# Altium schematic sheet Cpcis_connectors_P4_P5_P6.SchDoc
size 420 x 297 mm; DocumentNumber: 4; SheetNumber: 4; SheetTotal: 8; EDA_Number: ARTIQ; ModifiedBy: -; Title2: -; DivGrp: ISE; ModifiedDate: -
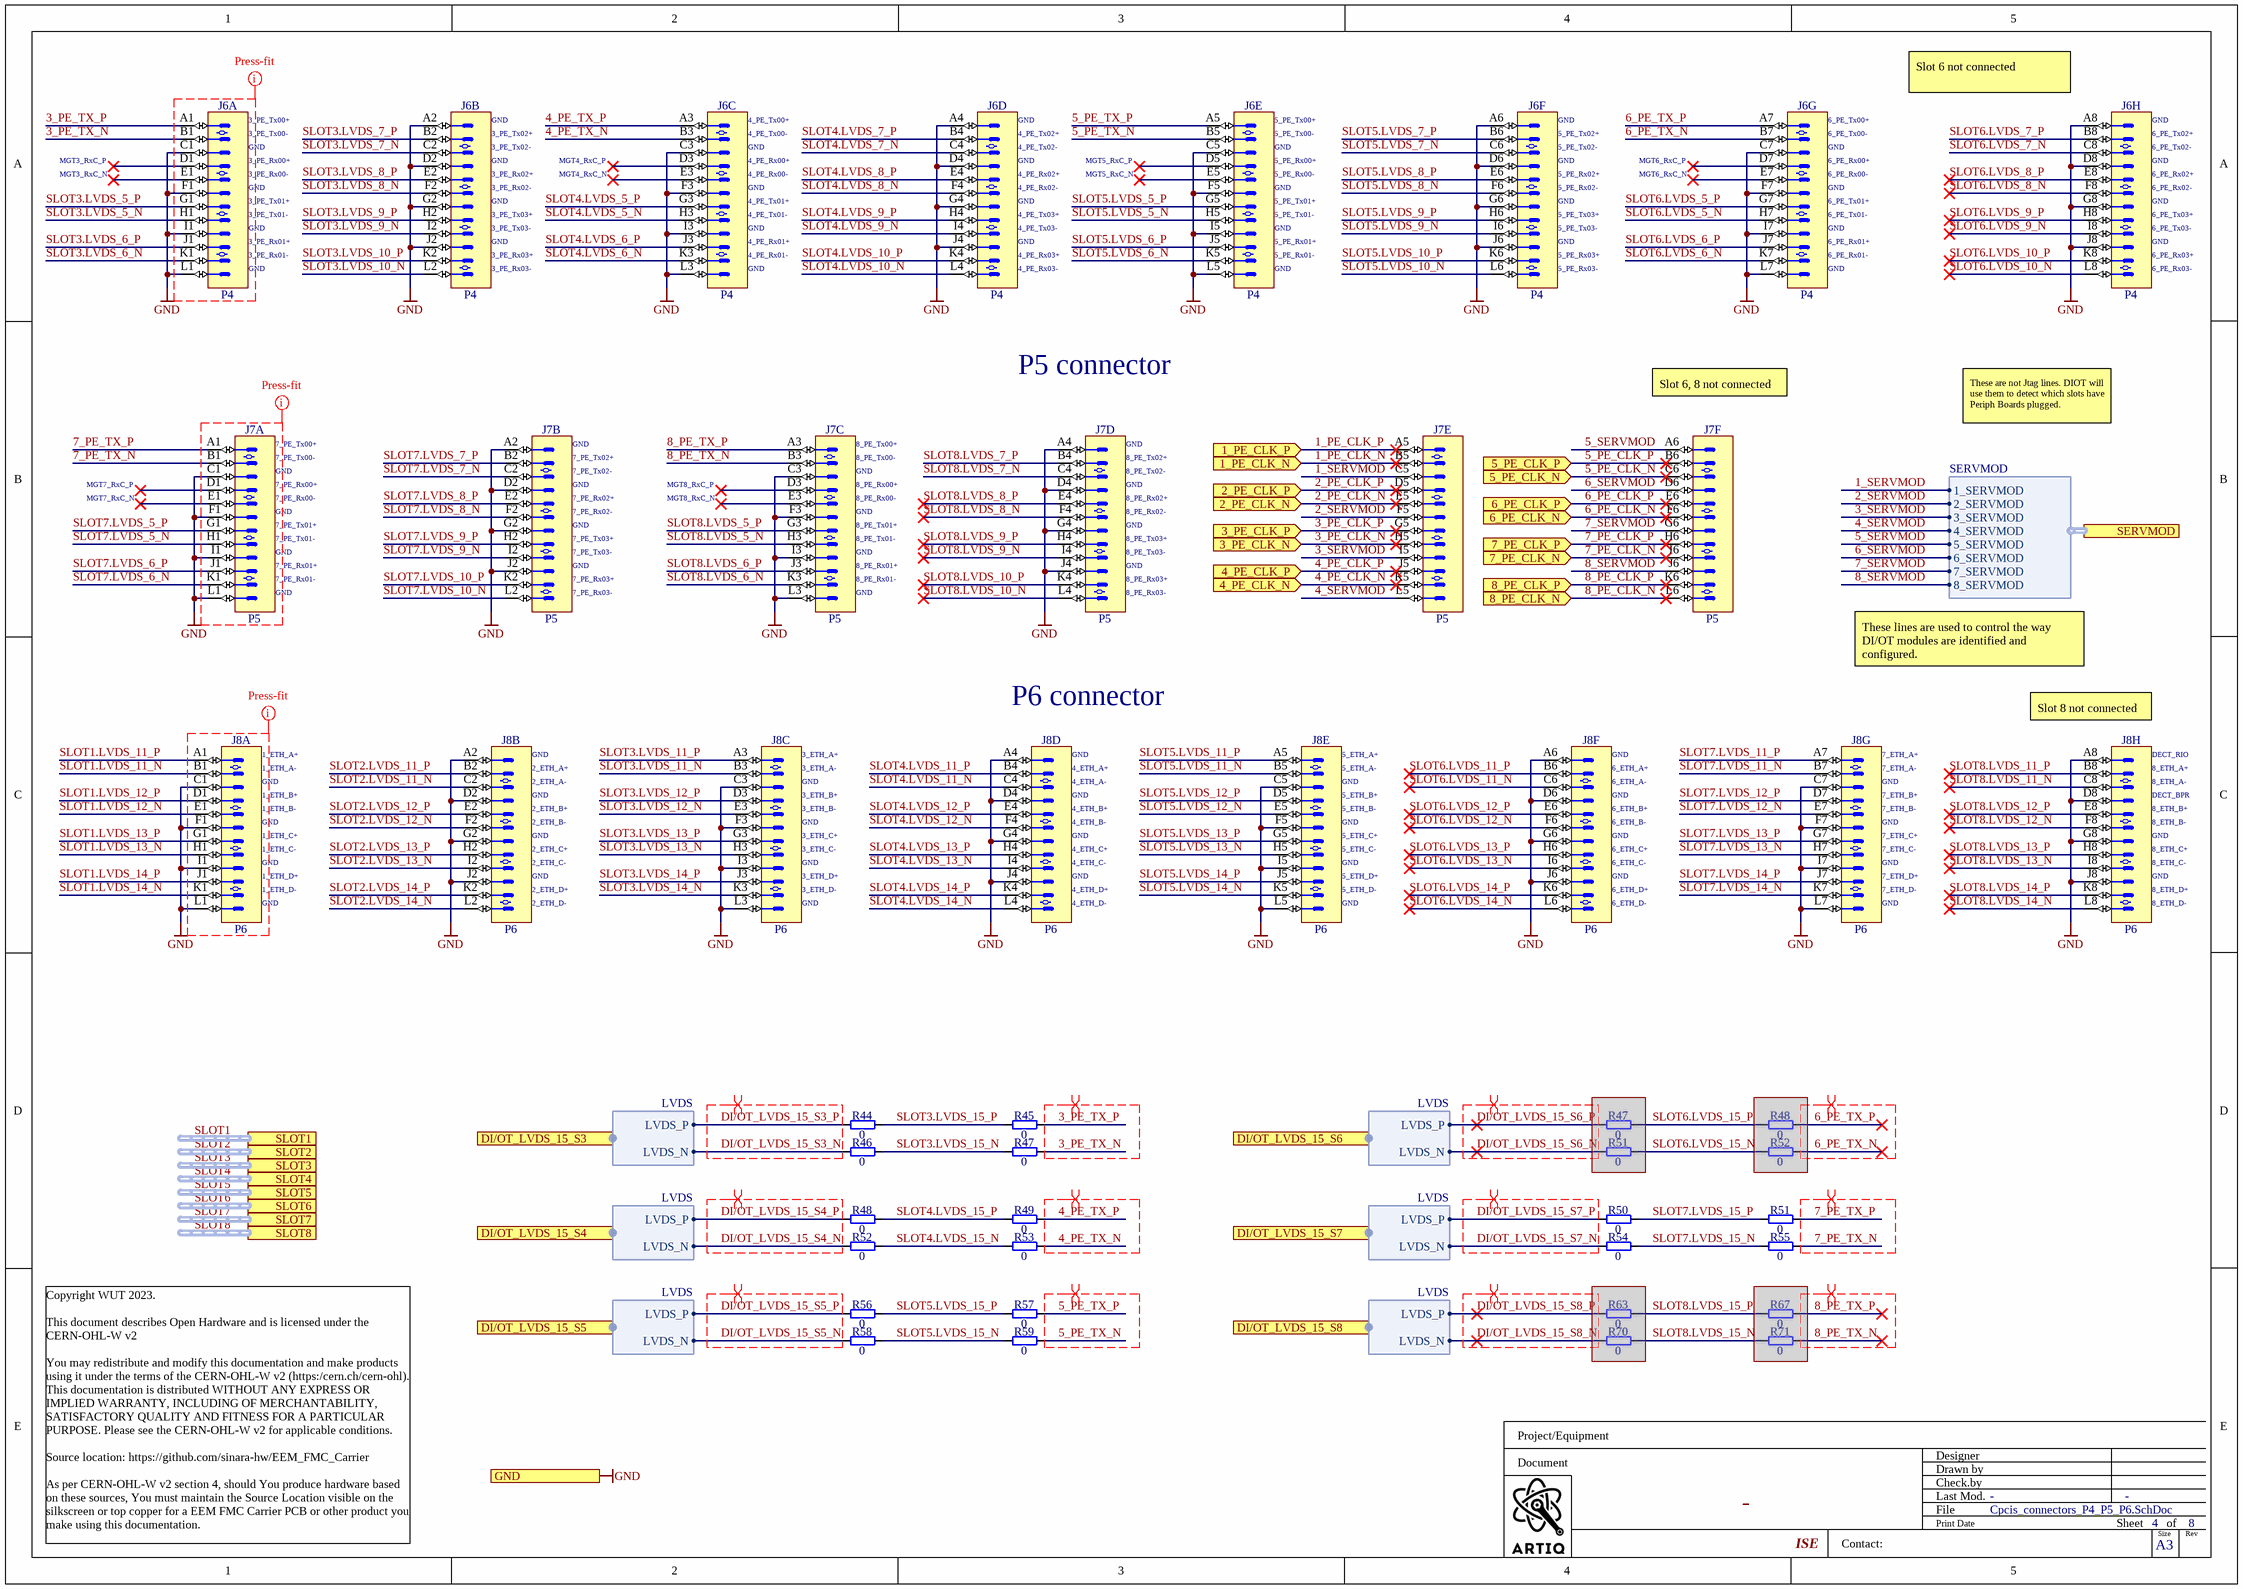
[diagram p0: Cpcis_connectors_P4_P5_P6.SchDoc]

## Parts
(Parts that share a designator on the sheet are numbered #1, #2 ... from top to bottom, then left to right.)
J6  P4  [AMPHENOL_10052837-101LF]  (parts A,B,C,D,E,F,G,H of 8)
J7  P5  [AMPHENOL_10052824-101LF]  (parts A,B,C,D,E,F of 6)
J8  P6  [AMPHENOL_10052838-101LF]  (parts A,B,C,D,E,F,G,H of 8)
R44  0  [RESC0603X28N]
R45  0  [RESC0603X28N]
R46  0  [RESC0603X28N]
R47#1  0  [RESC0603X28N]  (masked out: inside a compile mask, not in the netlist)
R47#2  0  [RESC0603X28N]
R48#1  0  [RESC0603X28N]  (masked out: inside a compile mask, not in the netlist)
R48#2  0  [RESC0603X28N]
R49  0  [RESC0603X28N]
R50  0  [RESC0603X28N]
R51#1  0  [RESC0603X28N]  (masked out: inside a compile mask, not in the netlist)
R51#2  0  [RESC0603X28N]
R52#1  0  [RESC0603X28N]  (masked out: inside a compile mask, not in the netlist)
R52#2  0  [RESC0603X28N]
R53  0  [RESC0603X28N]
R54  0  [RESC0603X28N]
R55  0  [RESC0603X28N]
R56  0  [RESC0603X28N]
R57  0  [RESC0603X28N]
R58  0  [RESC0603X28N]
R59  0  [RESC0603X28N]
R63  0  [RESC0603X28N]  (masked out: inside a compile mask, not in the netlist)
R67  0  [RESC0603X28N]  (masked out: inside a compile mask, not in the netlist)
R70  0  [RESC0603X28N]  (masked out: inside a compile mask, not in the netlist)
R71  0  [RESC0603X28N]  (masked out: inside a compile mask, not in the netlist)

## Ports
1_PE_CLK_N (in), 1_PE_CLK_P (in), 2_PE_CLK_N (in), 2_PE_CLK_P (in), 3_PE_CLK_N (in), 3_PE_CLK_P (in), 4_PE_CLK_N (in), 4_PE_CLK_P (in), 5_PE_CLK_N (in), 5_PE_CLK_P (in), 6_PE_CLK_N (in), 6_PE_CLK_P (in), 7_PE_CLK_N (in), 7_PE_CLK_P (in), 8_PE_CLK_N (in), 8_PE_CLK_P (in), DI/OT_LVDS_15_S3 (harness LVDS), DI/OT_LVDS_15_S4 (harness LVDS), DI/OT_LVDS_15_S5 (harness LVDS), DI/OT_LVDS_15_S6 (harness LVDS), DI/OT_LVDS_15_S7 (harness LVDS), DI/OT_LVDS_15_S8 (harness LVDS), GND, SERVMOD (harness SERVMOD), SLOT1 (harness SLOT), SLOT2 (harness SLOT), SLOT3 (harness SLOT), SLOT4 (harness SLOT), SLOT5 (harness SLOT), SLOT6 (harness ExtensionConnector), SLOT7 (harness SLOT), SLOT8 (harness ExtensionConnector)

## Harnesses
LVDS: LVDS_P, LVDS_N
SERVMOD: 5_SERVMOD, 6_SERVMOD, 2_SERVMOD, 7_SERVMOD, 3_SERVMOD, 4_SERVMOD, 1_SERVMOD, 8_SERVMOD

## Nets
GND: J6.A2 J6.A4 J6.A6 J6.A8 J6.C1 J6.C3 J6.C5 J6.C7 J6.D2 J6.D4 J6.D6 J6.D8 J6.F1 J6.F3 J6.F5 J6.F7 J6.G2 J6.G4 J6.G6 J6.G8 J6.I1 J6.I3 J6.I5 J6.I7 J6.J2 J6.J4 J6.J6 J6.J8 J6.L1 J6.L3 J6.L5 J6.L7 J7.A2 J7.A4 J7.C1 J7.C3 J7.D2 J7.D4 J7.F1 J7.F3 J7.G2 J7.G4 J7.I1 J7.I3 J7.J2 J7.J4 J7.L1 J7.L3 J8.A2 J8.A4 J8.A6 J8.A8 J8.C1 J8.C3 J8.C5 J8.C7 J8.D2 J8.D4 J8.D6 J8.D8 J8.F1 J8.F3 J8.F5 J8.F7 J8.G2 J8.G4 J8.G6 J8.G8 J8.I1 J8.I3 J8.I5 J8.I7 J8.J2 J8.J4 J8.J6 J8.J8 J8.L1 J8.L3 J8.L5 J8.L7 ; port GND
1_PE_CLK_N: J7.B5 ; port 1_PE_CLK_N
1_PE_CLK_P: J7.A5 ; port 1_PE_CLK_P
1_SERVMOD: J7.C5 ; port SERVMOD.1_SERVMOD
2_PE_CLK_N: J7.E5 ; port 2_PE_CLK_N
2_PE_CLK_P: J7.D5 ; port 2_PE_CLK_P
2_SERVMOD: J7.F5 ; port SERVMOD.2_SERVMOD
3_PE_CLK_N: J7.H5 ; port 3_PE_CLK_N
3_PE_CLK_P: J7.G5 ; port 3_PE_CLK_P
3_PE_TX_N: J6.B1 R47#2.2
3_PE_TX_P: J6.A1 R45.2
3_SERVMOD: J7.I5 ; port SERVMOD.3_SERVMOD
4_PE_CLK_N: J7.K5 ; port 4_PE_CLK_N
4_PE_CLK_P: J7.J5 ; port 4_PE_CLK_P
4_PE_TX_N: J6.B3 R53.2
4_PE_TX_P: J6.A3 R49.2
4_SERVMOD: J7.L5 ; port SERVMOD.4_SERVMOD
5_PE_CLK_N: J7.C6 ; port 5_PE_CLK_N
5_PE_CLK_P: J7.B6 ; port 5_PE_CLK_P
5_PE_TX_N: J6.B5 R59.2
5_PE_TX_P: J6.A5 R57.2
5_SERVMOD: J7.A6 ; port SERVMOD.5_SERVMOD
6_PE_CLK_N: J7.F6 ; port 6_PE_CLK_N
6_PE_CLK_P: J7.E6 ; port 6_PE_CLK_P
6_PE_TX_N: J6.B7
6_PE_TX_P: J6.A7
6_SERVMOD: J7.D6 ; port SERVMOD.6_SERVMOD
7_PE_CLK_N: J7.I6 ; port 7_PE_CLK_N
7_PE_CLK_P: J7.H6 ; port 7_PE_CLK_P
7_PE_TX_N: J7.B1 R55.2
7_PE_TX_P: J7.A1 R51#2.2
7_SERVMOD: J7.G6 ; port SERVMOD.7_SERVMOD
8_PE_CLK_N: J7.L6 ; port 8_PE_CLK_N
8_PE_CLK_P: J7.K6 ; port 8_PE_CLK_P
8_PE_TX_N: J7.B3
8_PE_TX_P: J7.A3
8_SERVMOD: J7.J6 ; port SERVMOD.8_SERVMOD
DI/OT_LVDS_15_S3_N: R46.1 ; port DI/OT_LVDS_15_S3.LVDS_N
DI/OT_LVDS_15_S3_P: R44.1 ; port DI/OT_LVDS_15_S3.LVDS_P
DI/OT_LVDS_15_S4_N: R52#2.1 ; port DI/OT_LVDS_15_S4.LVDS_N
DI/OT_LVDS_15_S4_P: R48#2.1 ; port DI/OT_LVDS_15_S4.LVDS_P
DI/OT_LVDS_15_S5_N: R58.1 ; port DI/OT_LVDS_15_S5.LVDS_N
DI/OT_LVDS_15_S5_P: R56.1 ; port DI/OT_LVDS_15_S5.LVDS_P
DI/OT_LVDS_15_S6_N: port DI/OT_LVDS_15_S6.LVDS_N
DI/OT_LVDS_15_S6_P: port DI/OT_LVDS_15_S6.LVDS_P
DI/OT_LVDS_15_S7_N: R54.1 ; port DI/OT_LVDS_15_S7.LVDS_N
DI/OT_LVDS_15_S7_P: R50.1 ; port DI/OT_LVDS_15_S7.LVDS_P
DI/OT_LVDS_15_S8_N: port DI/OT_LVDS_15_S8.LVDS_N
DI/OT_LVDS_15_S8_P: port DI/OT_LVDS_15_S8.LVDS_P
SLOT1.LVDS_11_N: J8.B1
SLOT1.LVDS_11_P: J8.A1
SLOT1.LVDS_12_N: J8.E1
SLOT1.LVDS_12_P: J8.D1
SLOT1.LVDS_13_N: J8.H1
SLOT1.LVDS_13_P: J8.G1
SLOT1.LVDS_14_N: J8.K1
SLOT1.LVDS_14_P: J8.J1
SLOT2.LVDS_11_N: J8.C2
SLOT2.LVDS_11_P: J8.B2
SLOT2.LVDS_12_N: J8.F2
SLOT2.LVDS_12_P: J8.E2
SLOT2.LVDS_13_N: J8.I2
SLOT2.LVDS_13_P: J8.H2
SLOT2.LVDS_14_N: J8.L2
SLOT2.LVDS_14_P: J8.K2
SLOT3.LVDS_5_N: J6.H1
SLOT3.LVDS_5_P: J6.G1
SLOT3.LVDS_6_N: J6.K1
SLOT3.LVDS_6_P: J6.J1
SLOT3.LVDS_7_N: J6.C2
SLOT3.LVDS_7_P: J6.B2
SLOT3.LVDS_8_N: J6.F2
SLOT3.LVDS_8_P: J6.E2
SLOT3.LVDS_9_N: J6.I2
SLOT3.LVDS_9_P: J6.H2
SLOT3.LVDS_10_N: J6.L2
SLOT3.LVDS_10_P: J6.K2
SLOT3.LVDS_11_N: J8.B3
SLOT3.LVDS_11_P: J8.A3
SLOT3.LVDS_12_N: J8.E3
SLOT3.LVDS_12_P: J8.D3
SLOT3.LVDS_13_N: J8.H3
SLOT3.LVDS_13_P: J8.G3
SLOT3.LVDS_14_N: J8.K3
SLOT3.LVDS_14_P: J8.J3
SLOT3.LVDS_15_N: R46.2 R47#2.1
SLOT3.LVDS_15_P: R44.2 R45.1
SLOT4.LVDS_5_N: J6.H3
SLOT4.LVDS_5_P: J6.G3
SLOT4.LVDS_6_N: J6.K3
SLOT4.LVDS_6_P: J6.J3
SLOT4.LVDS_7_N: J6.C4
SLOT4.LVDS_7_P: J6.B4
SLOT4.LVDS_8_N: J6.F4
SLOT4.LVDS_8_P: J6.E4
SLOT4.LVDS_9_N: J6.I4
SLOT4.LVDS_9_P: J6.H4
SLOT4.LVDS_10_N: J6.L4
SLOT4.LVDS_10_P: J6.K4
SLOT4.LVDS_11_N: J8.C4
SLOT4.LVDS_11_P: J8.B4
SLOT4.LVDS_12_N: J8.F4
SLOT4.LVDS_12_P: J8.E4
SLOT4.LVDS_13_N: J8.I4
SLOT4.LVDS_13_P: J8.H4
SLOT4.LVDS_14_N: J8.L4
SLOT4.LVDS_14_P: J8.K4
SLOT4.LVDS_15_N: R52#2.2 R53.1
SLOT4.LVDS_15_P: R48#2.2 R49.1
SLOT5.LVDS_5_N: J6.H5
SLOT5.LVDS_5_P: J6.G5
SLOT5.LVDS_6_N: J6.K5
SLOT5.LVDS_6_P: J6.J5
SLOT5.LVDS_7_N: J6.C6
SLOT5.LVDS_7_P: J6.B6
SLOT5.LVDS_8_N: J6.F6
SLOT5.LVDS_8_P: J6.E6
SLOT5.LVDS_9_N: J6.I6
SLOT5.LVDS_9_P: J6.H6
SLOT5.LVDS_10_N: J6.L6
SLOT5.LVDS_10_P: J6.K6
SLOT5.LVDS_11_N: J8.B5
SLOT5.LVDS_11_P: J8.A5
SLOT5.LVDS_12_N: J8.E5
SLOT5.LVDS_12_P: J8.D5
SLOT5.LVDS_13_N: J8.H5
SLOT5.LVDS_13_P: J8.G5
SLOT5.LVDS_14_N: J8.K5
SLOT5.LVDS_14_P: J8.J5
SLOT5.LVDS_15_N: R58.2 R59.1
SLOT5.LVDS_15_P: R56.2 R57.1
SLOT6.LVDS_5_N: J6.H7
SLOT6.LVDS_5_P: J6.G7
SLOT6.LVDS_6_N: J6.K7
SLOT6.LVDS_6_P: J6.J7
SLOT6.LVDS_7_N: J6.C8
SLOT6.LVDS_7_P: J6.B8
SLOT6.LVDS_8_N: J6.F8
SLOT6.LVDS_8_P: J6.E8
SLOT6.LVDS_9_N: J6.I8
SLOT6.LVDS_9_P: J6.H8
SLOT6.LVDS_10_N: J6.L8
SLOT6.LVDS_10_P: J6.K8
SLOT6.LVDS_11_N: J8.C6
SLOT6.LVDS_11_P: J8.B6
SLOT6.LVDS_12_N: J8.F6
SLOT6.LVDS_12_P: J8.E6
SLOT6.LVDS_13_N: J8.I6
SLOT6.LVDS_13_P: J8.H6
SLOT6.LVDS_14_N: J8.L6
SLOT6.LVDS_14_P: J8.K6
SLOT7.LVDS_5_N: J7.H1
SLOT7.LVDS_5_P: J7.G1
SLOT7.LVDS_6_N: J7.K1
SLOT7.LVDS_6_P: J7.J1
SLOT7.LVDS_7_N: J7.C2
SLOT7.LVDS_7_P: J7.B2
SLOT7.LVDS_8_N: J7.F2
SLOT7.LVDS_8_P: J7.E2
SLOT7.LVDS_9_N: J7.I2
SLOT7.LVDS_9_P: J7.H2
SLOT7.LVDS_10_N: J7.L2
SLOT7.LVDS_10_P: J7.K2
SLOT7.LVDS_11_N: J8.B7
SLOT7.LVDS_11_P: J8.A7
SLOT7.LVDS_12_N: J8.E7
SLOT7.LVDS_12_P: J8.D7
SLOT7.LVDS_13_N: J8.H7
SLOT7.LVDS_13_P: J8.G7
SLOT7.LVDS_14_N: J8.K7
SLOT7.LVDS_14_P: J8.J7
SLOT7.LVDS_15_N: R54.2 R55.1
SLOT7.LVDS_15_P: R50.2 R51#2.1
SLOT8.LVDS_5_N: J7.H3
SLOT8.LVDS_5_P: J7.G3
SLOT8.LVDS_6_N: J7.K3
SLOT8.LVDS_6_P: J7.J3
SLOT8.LVDS_7_N: J7.C4
SLOT8.LVDS_7_P: J7.B4
SLOT8.LVDS_8_N: J7.F4
SLOT8.LVDS_8_P: J7.E4
SLOT8.LVDS_9_N: J7.I4
SLOT8.LVDS_9_P: J7.H4
SLOT8.LVDS_10_N: J7.L4
SLOT8.LVDS_10_P: J7.K4
SLOT8.LVDS_11_N: J8.C8
SLOT8.LVDS_11_P: J8.B8
SLOT8.LVDS_12_N: J8.F8
SLOT8.LVDS_12_P: J8.E8
SLOT8.LVDS_13_N: J8.I8
SLOT8.LVDS_13_P: J8.H8
SLOT8.LVDS_14_N: J8.L8
SLOT8.LVDS_14_P: J8.K8

Not connected (* = marked no-connect by the designer): J6 D1* D3* D5* D7* E1* E3* E5* E7*; J7 D1* D3* E1* E3*

## Buses and harness runs
harness SLOT1 = port SLOT1
harness SLOT2 = port SLOT2
harness SLOT3 = port SLOT3
harness SLOT4 = port SLOT4
harness SLOT5 = port SLOT5
harness SLOT6 = port SLOT6
harness SLOT7 = port SLOT7
harness SLOT8 = port SLOT8

## Layout directives
differential pair: 3_PE_TX_N, 3_PE_TX_P, 4_PE_TX_N, 4_PE_TX_P, 5_PE_TX_N, 5_PE_TX_P, 6_PE_TX_N, 6_PE_TX_P, 7_PE_TX_N, 7_PE_TX_P, 8_PE_TX_N, 8_PE_TX_P, DI/OT_LVDS_15_S3_N, DI/OT_LVDS_15_S3_P, DI/OT_LVDS_15_S4_N, DI/OT_LVDS_15_S4_P, DI/OT_LVDS_15_S5_N, DI/OT_LVDS_15_S5_P, DI/OT_LVDS_15_S6_N, DI/OT_LVDS_15_S6_P, DI/OT_LVDS_15_S7_N, DI/OT_LVDS_15_S7_P, DI/OT_LVDS_15_S8_N, DI/OT_LVDS_15_S8_P
CompClassName: Press-fit: (no net found under the mark)

## Notes on the sheet
- (near J6) 3_PE_Tx00+
- (near J6) GND
- (near J6) 4_PE_Tx00+
- (near J6) 5_PE_Tx00+
- (near J6) 6_PE_Tx00+
- (near J6) Slot 6 not connected
- MGT3_RxC_P
- MGT3_RxC_N
- (near J6) 3_PE_Tx00-
- (near J6) 3_PE_Rx00+
- (near J6) 3_PE_Rx00-
- (near J6) 3_PE_Tx02+
- (near J6) 3_PE_Tx02-
- (near J6) 3_PE_Rx02+
- (near J6) 3_PE_Rx02-
- MGT4_RxC_P
- MGT4_RxC_N
- (near J6) 4_PE_Tx00-
- (near J6) 4_PE_Rx00+
- (near J6) 4_PE_Rx00-
- (near J6) 4_PE_Tx02+
- (near J6) 4_PE_Tx02-
- (near J6) 4_PE_Rx02+
- (near J6) 4_PE_Rx02-
- MGT5_RxC_P
- MGT5_RxC_N
- (near J6) 5_PE_Tx00-
- (near J6) 5_PE_Rx00+
- (near J6) 5_PE_Rx00-
- (near J6) 5_PE_Tx02+
- (near J6) 5_PE_Tx02-
- (near J6) 5_PE_Rx02+
- (near J6) 5_PE_Rx02-
- MGT6_RxC_P
- MGT6_RxC_N
- (near J6) 6_PE_Tx00-
- (near J6) 6_PE_Rx00+
- (near J6) 6_PE_Rx00-
- (near J6) 6_PE_Tx02+
- (near J6) 6_PE_Tx02-
- (near J6) 6_PE_Rx02+
- (near J6) 6_PE_Rx02-
- (near J6) 3_PE_Tx01+
- (near J6) 3_PE_Tx01-
- (near J6) 3_PE_Rx01+
- (near J6) 3_PE_Rx01-
- (near J6) 3_PE_Tx03+
- (near J6) 3_PE_Tx03-
- (near J6) 3_PE_Rx03+
- (near J6) 4_PE_Tx01+
- (near J6) 4_PE_Tx01-
- (near J6) 4_PE_Rx01+
- (near J6) 4_PE_Rx01-
- (near J6) 4_PE_Tx03+
- (near J6) 4_PE_Tx03-
- (near J6) 4_PE_Rx03+
- (near J6) 5_PE_Tx01+
- (near J6) 5_PE_Tx01-
- (near J6) 5_PE_Rx01+
- (near J6) 5_PE_Rx01-
- (near J6) 5_PE_Tx03+
- (near J6) 5_PE_Tx03-
- (near J6) 5_PE_Rx03+
- (near J6) 6_PE_Tx01+
- (near J6) 6_PE_Tx01-
- (near J6) 6_PE_Rx01+
- (near J6) 6_PE_Rx01-
- (near J6) 6_PE_Tx03+
- (near J6) 6_PE_Tx03-
- (near J6) 6_PE_Rx03+
- (near J6) 3_PE_Rx03-
- (near J6) 4_PE_Rx03-
- (near J6) 5_PE_Rx03-
- (near J6) 6_PE_Rx03-
- P5 connector
- Slot 6, 8 not connected
- (near J7) 7_PE_Tx00+
- (near J7) 7_PE_Tx00-
- (near J7) GND
- (near J7) 7_PE_Tx02+
- (near J7) 8_PE_Tx00+
- (near J7) 8_PE_Tx00-
- (near J7) 8_PE_Tx02+
- These are not Jtag lines. DIOT will use them to detect which slots have Periph Boards plugged.
- MGT7_RxC_P
- MGT7_RxC_N
- (near J7) 7_PE_Tx01+
- (near J7) 7_PE_Rx00+
- (near J7) 7_PE_Rx00-
- (near J7) 7_PE_Tx02-
- (near J7) 7_PE_Rx02+
- (near J7) 7_PE_Rx02-
- MGT8_RxC_P
- MGT8_RxC_N
- (near J7) 8_PE_Tx01+
- (near J7) 8_PE_Rx00+
- (near J7) 8_PE_Rx00-
- (near J7) 8_PE_Tx02-
- (near J7) 8_PE_Rx02+
- (near J7) 8_PE_Rx02-
- (near J7) 7_PE_Tx01-
- (near J7) 7_PE_Rx01+
- (near J7) 7_PE_Rx01-
- (near J7) 7_PE_Tx03+
- (near J7) 7_PE_Tx03-
- (near J7) 7_PE_Rx03+
- (near J7) 7_PE_Rx03-
- (near J7) 8_PE_Tx01-
- (near J7) 8_PE_Rx01+
- (near J7) 8_PE_Rx01-
- (near J7) 8_PE_Tx03+
- (near J7) 8_PE_Tx03-
- (near J7) 8_PE_Rx03+
- (near J7) 8_PE_Rx03-
- These lines are used to control the way DI/OT modules are identified and configured.
- (near J8) P6 connector
- (near J8) Slot 8 not connected
- (near J8) 1_ETH_A+
- (near J8) 1_ETH_A-
- (near J8) GND
- (near J8) 1_ETH_B+
- (near J8) 2_ETH_A+
- (near J8) 2_ETH_A-
- (near J8) 3_ETH_A+
- (near J8) 3_ETH_A-
- (near J8) 3_ETH_B+
- (near J8) 4_ETH_A+
- (near J8) 4_ETH_A-
- (near J8) 5_ETH_A+
- (near J8) 5_ETH_A-
- (near J8) 5_ETH_B+
- (near J8) 6_ETH_A+
- (near J8) 6_ETH_A-
- (near J8) 7_ETH_A+
- (near J8) 7_ETH_A-
- (near J8) 7_ETH_B+
- (near J8) DECT_RIO
- (near J8) 8_ETH_A+
- (near J8) 8_ETH_A-
- (near J8) DECT_BPR
- (near J8) 1_ETH_B-
- (near J8) 1_ETH_C+
- (near J8) 1_ETH_C-
- (near J8) 2_ETH_B+
- (near J8) 2_ETH_B-
- (near J8) 2_ETH_C+
- (near J8) 2_ETH_C-
- (near J8) 3_ETH_B-
- (near J8) 3_ETH_C+
- (near J8) 3_ETH_C-
- (near J8) 4_ETH_B+
- (near J8) 4_ETH_B-
- (near J8) 4_ETH_C+
- (near J8) 4_ETH_C-
- (near J8) 5_ETH_B-
- (near J8) 5_ETH_C+
- (near J8) 5_ETH_C-
- (near J8) 6_ETH_B+
- (near J8) 6_ETH_B-
- (near J8) 6_ETH_C+
- (near J8) 6_ETH_C-
- (near J8) 7_ETH_B-
- (near J8) 7_ETH_C+
- (near J8) 7_ETH_C-
- (near J8) 8_ETH_B+
- (near J8) 8_ETH_B-
- (near J8) 8_ETH_C+
- (near J8) 8_ETH_C-
- (near J8) 1_ETH_D+
- (near J8) 1_ETH_D-
- (near J8) 2_ETH_D+
- (near J8) 2_ETH_D-
- (near J8) 3_ETH_D+
- (near J8) 3_ETH_D-
- (near J8) 4_ETH_D+
- (near J8) 4_ETH_D-
- (near J8) 5_ETH_D+
- (near J8) 5_ETH_D-
- (near J8) 6_ETH_D+
- (near J8) 6_ETH_D-
- (near J8) 7_ETH_D+
- (near J8) 7_ETH_D-
- (near J8) 8_ETH_D+
- (near J8) 8_ETH_D-
- Labels drawn without touching a wire or pin: SLOT6.LVDS_15_N, SLOT6.LVDS_15_P, SLOT8.LVDS_15_N, SLOT8.LVDS_15_P
- Project/Equipment
- Document
- Designer
- Drawn by
- Check.by
- Copyright WUT 2023.
  This document describes Open Hardware and is licensed under the CERN-OHL-W v2
  You may redistribute and modify this documentation and make products using it under the terms of the CERN-OHL-W v2 (https:/cern.ch/cern-ohl). This documentation is distributed WITHOUT ANY EXPRESS OR IMPLIED WARRANTY, INCLUDING OF MERCHANTABILITY, SATISFACTORY QUALITY AND FITNESS FOR A PARTICULAR PURPOSE. Please see the CERN-OHL-W v2 for applicable conditions.
  Source location: https://github.com/sinara-hw/EEM_FMC_Carrier
  As per CERN-OHL-W v2 section 4, should You produce hardware based on these sources, You must maintain the Source Location visible on the silkscreen or top copper for a EEM FMC Carrier PCB or other product you make using this documentation.
- Contact:
- File
- Last Mod.
- Print Date
- Sheet
- Size
- A3
- of
- Rev

## Library data of the parts
J6 = AMPHENOL_10052837-101LF: 96 Contacts Header, 8 Columns, 4 Pairs per Column; Part Description: 96 Contacts, 2mm Pitch, 8 Columns, 4 Pairs per Column, 2 Walls, Right Angle Header; Part Number: AMPHENOL_10052837-101LF; Component Kind: Standard; Component Type: Standard; Pin Count: 96; Family: AirMax VS; Mounted: Yes; Socket: No; SMD: No; PressFit: Yes; Sense: No; Status: None; Manufacturer: AMPHENOL; Manufacturer Part Number: 10052837-101LF; ComponentHeight: 15.35mm; HelpURL: \\cern.ch\dfs\Applications\Altium\Datasheets\AMPHENOL_10052837-101LF.pdf; ComponentLink1URL: \\cern.ch\dfs\Applications\Altium\Datasheets\AMPHENOL_10052837-101LF_Application.pdf; ComponentLink1Description: Application; Author: CERN DEM MR; CreateDate: 19/02/2018; LatestRevisionDate: 19/02/2018
J7 = AMPHENOL_10052824-101LF: 72 Contacts Header, 6 Columns, 4 Pairs per Column; Part Description: 72 Contacts, 2mm Pitch, 6 Columns, 4 Pairs per Column, 2 Walls, Right Angle Header; Part Number: AMPHENOL_10052824-101LF; Component Kind: Standard; Component Type: Standard; Pin Count: 72; Family: AirMax VS; Mounted: Yes; Socket: No; SMD: No; PressFit: Yes; Sense: No; Status: None; Manufacturer: AMPHENOL; Manufacturer Part Number: 10052824-101LF; ComponentHeight: 15.35mm; HelpURL: \\cern.ch\dfs\Applications\Altium\Datasheets\AMPHENOL_10052824-101LF.pdf; ComponentLink1URL: \\cern.ch\dfs\Applications\Altium\Datasheets\AMPHENOL_10052824-101LF_Application.pdf; ComponentLink1Description: Application; Author: CERN DEM JMW; CreateDate: 29/11/2017; LatestRevisionDate: 29/11/2017
J8 = AMPHENOL_10052838-101LF: 96 Contacts Header, 8 Columns, 4 Pairs per Column; Part Description: 96 Contacts, 2mm Pitch, 8 Columns, 4 Pairs per Column, 4 Walls, Right Angle Header; Part Number: AMPHENOL_10052838-101LF; Component Kind: Standard; Component Type: Standard; Pin Count: 96; Family: AirMax VS; Mounted: Yes; Socket: No; SMD: No; PressFit: Yes; Sense: No; Status: None; Manufacturer: AMPHENOL; Manufacturer Part Number: 10052838-101LF; ComponentHeight: 15.35mm; HelpURL: \\cern.ch\dfs\Applications\Altium\Datasheets\AMPHENOL_10052838-101LF.pdf; ComponentLink1URL: \\cern.ch\dfs\Applications\Altium\Datasheets\AMPHENOL_10052838-101LF_Application.pdf; ComponentLink1Description: Application; Author: CERN DEM MR; CreateDate: 19/02/2018; LatestRevisionDate: 19/02/2018; Classname: Overlapping
R44-R46 R47#1 R47#2 R48#1 R48#2 R49 R50 R51#1 R51#2 R52#1 R52#2 R53-R59 R63 R67 R70 R71 = R0201_0R_JUMPER: Resistor; Part Description: 1A (0.05R Max DC Resistance) Zero Ohm Jumper; Manufacturer: GENERIC; Manufacturer1 Part Number: CRCW02010000Z0ED; PressFit: No; Part Number: R0201_0R_JUMPER; Component Kind: Standard; Component Type: Standard; Pin Count: 2; Value: 0; Status: Not Recommended; Manufacturer Part Number: R0201_0R_JUMPER; Case: 0201; Mounted: Yes; Sense: No; Socket: No; SMD: Yes; Manufacturer1 Example: VISHAY; Manufacturer1 ComponentHeight: 0.27mm; HelpURL: \\cern.ch\dfs\Applications\Altium\Datasheets\R0201_VISHAY_CRCW e3.pdf; Author: CERN DEM JLC; CreateDate: 19.11.2014; LatestRevisionDate: 08.01.2015